# EAGLE design quadripod_v2 (EAGLE 9.3.0)
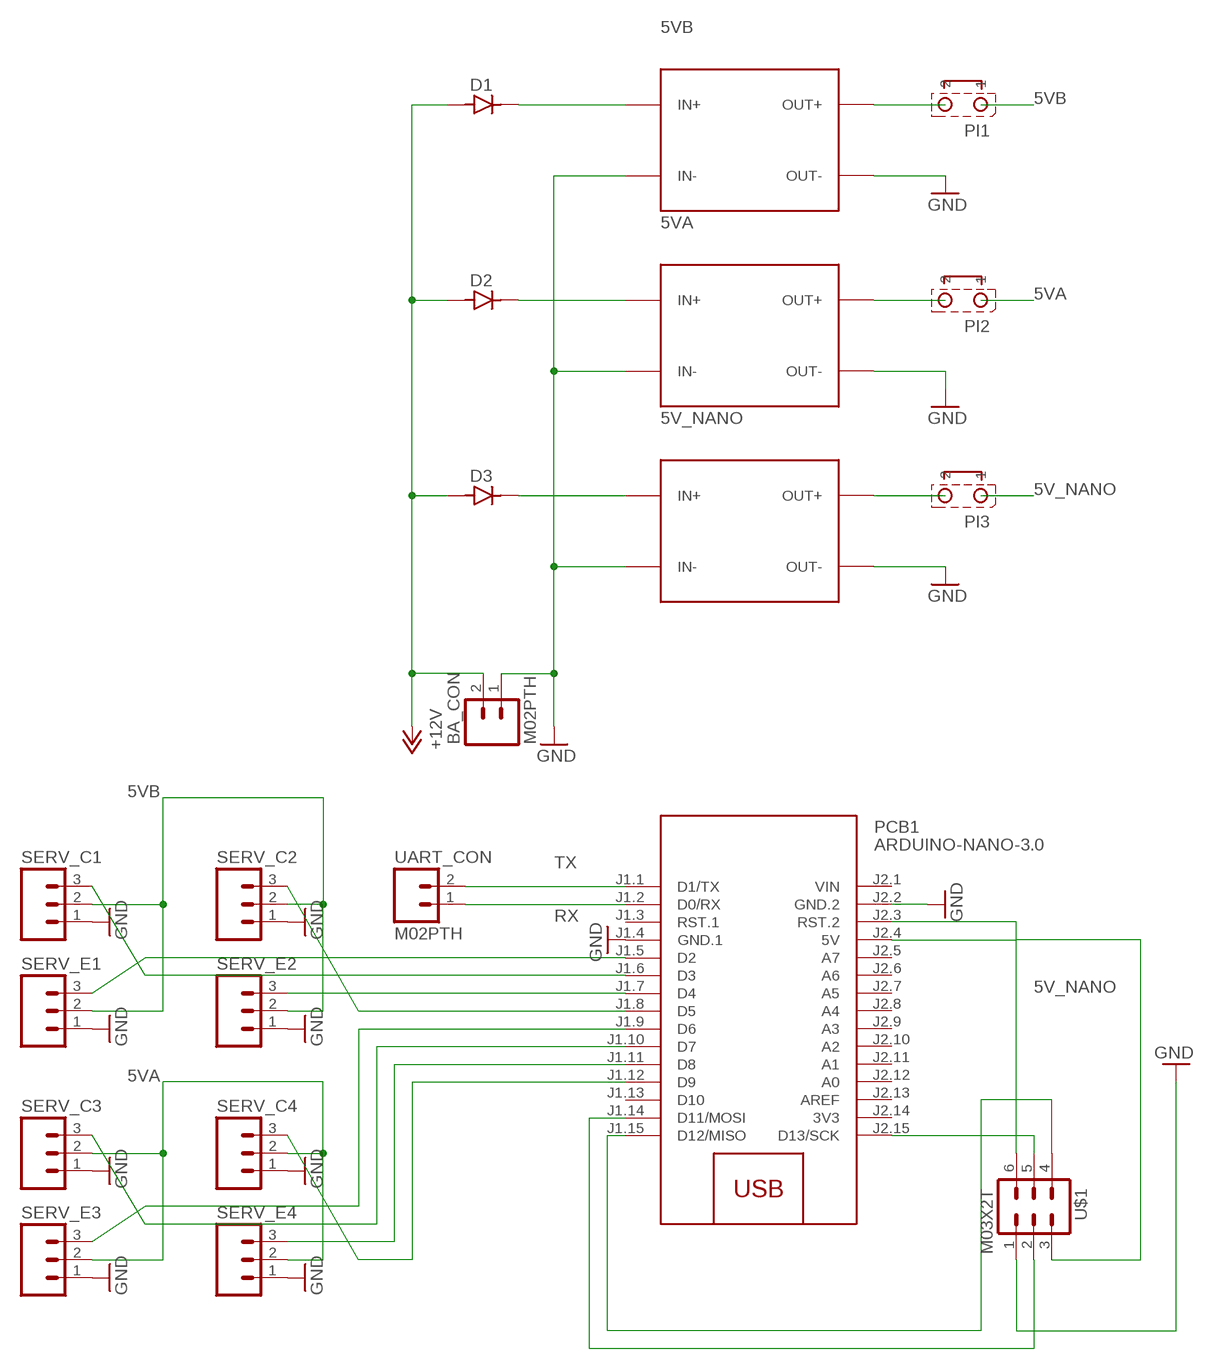
[diagram p0: schematic, sheet 1]

## Parts
5V_NANO  DC-DC-STEP-DOWN-LM2596  [DC-DC-STEP-DOWN-LM2596]
5VA  DC-DC-STEP-DOWN-LM2596  [DC-DC-STEP-DOWN-LM2596]
5VB  DC-DC-STEP-DOWN-LM2596  [DC-DC-STEP-DOWN-LM2596]
BA_CON  M02PTH  [1X02]
D1  DIODES_DIODE/DO41  [DIODES_DO41]
D2  DIODES_DIODE/DO41  [DIODES_DO41]
D3  DIODES_DIODE/DO41  [DIODES_DO41]
PCB1  ARDUINO-NANO-3.0  [ARDUINO-NANO-3.0]
PI1  STCMS_2  [STCMS_2]
PI2  STCMS_2  [STCMS_2]
PI3  STCMS_2  [STCMS_2]
SERV_C1  M03LONGPADS  [1X03_LONGPADS]
SERV_C2  M03LONGPADS  [1X03_LONGPADS]
SERV_C3  M03LONGPADS  [1X03_LONGPADS]
SERV_C4  M03LONGPADS  [1X03_LONGPADS]
SERV_E1  M03LONGPADS  [1X03_LONGPADS]
SERV_E2  M03LONGPADS  [1X03_LONGPADS]
SERV_E3  M03LONGPADS  [1X03_LONGPADS]
SERV_E4  M03LONGPADS  [1X03_LONGPADS]
U$1  M03X2T  [2X03]
UART_CON  M02PTH  [1X02]

## Nets
5V_NANO [power]: PCB1.J2.4(5V) PI3.1 U$1.3
5VA [power]: PI2.1 SERV_C3.2 SERV_C4.2 SERV_E3.2 SERV_E4.2
5VB: PI1.1 SERV_C1.2 SERV_C2.2 SERV_E1.2 SERV_E2.2
+12V [power]: BA_CON.2 D1.A D2.A D3.A
GND [power]: 5V_NANO.IN- 5V_NANO.OUT- 5VA.IN- 5VA.OUT- 5VB.IN- 5VB.OUT- BA_CON.1 PCB1.J1.4(GND.1) PCB1.J2.2(GND.2) SERV_C1.1 SERV_C2.1 SERV_C3.1 SERV_C4.1 SERV_E1.1 SERV_E2.1 SERV_E3.1 SERV_E4.1 U$1.1
N$1: 5VB.IN+ D1.K
N$2: PCB1.J1.5(D2) SERV_E1.3
N$3: 5VA.IN+ D2.K
N$4: 5V_NANO.IN+ D3.K
N$5: PCB1.J1.6(D3) SERV_C1.3
N$6: PCB1.J1.7(D4) SERV_E2.3
N$7: PCB1.J1.8(D5) SERV_C2.3
N$8: PCB1.J1.9(D6) SERV_E3.3
N$9: PCB1.J1.10(D7) SERV_C3.3
N$10: PCB1.J1.11(D8) SERV_E4.3
N$11: PCB1.J1.12(D9) SERV_C4.3
N$14: 5VB.OUT+ PI1.2
N$15: 5VA.OUT+ PI2.2
N$16: 5V_NANO.OUT+ PI3.2
N$17: PCB1.J1.14(D11/MOSI) U$1.2
N$18: PCB1.J2.3(RST.2) U$1.6
N$19: PCB1.J2.15(D13/SCK) U$1.5
N$20: PCB1.J1.15(D12/MISO) U$1.4
RX: PCB1.J1.2(D0/RX) UART_CON.1
TX: PCB1.J1.1(D1/TX) UART_CON.2
Unconnected: PCB1.J1.3(RST.1) PCB1.J1.13(D10) PCB1.J2.5(A7) PCB1.J2.6(A6) PCB1.J2.7(A5) PCB1.J2.8(A4) PCB1.J2.9(A3) PCB1.J2.10(A2) PCB1.J2.11(A1) PCB1.J2.12(A0) PCB1.J2.13(AREF)

## Power pins joined to a net without a drawn wire
3V3: PCB1.J2.14(3V3)
VIN: PCB1.J2.1(VIN)

## Library data of the parts
5V_NANO 5VA 5VB = diy-modules:DC-DC-STEP-DOWN-LM2596: DC/DC Step-Down Regulator based on LM2596-ADJ chip LM2596 datasheet available here: http://www.ti.com/lit/ds/symlink/lm2596.pdf Click here to find device on ebay.com <http://www.ebay.com/sch/lm2596+power+regulator>
BA_CON UART_CON = 7robot:M02: Standard 2-pin 2.54 header. Use with - straight break away headers ( PRT-00116) - right angle break away headers (PRT-00553) - swiss pins (PRT-00743) - machine pins (PRT-00117) - female headers (PRT-00115) Molex polarized connector foot print use with: PRT-08233 with associated crimp pins and housings. 2.54_SCREWTERM for use with PRT-10571. 3.5mm Screw Terminal footprints for PRT-08084 5mm Screw Terminal footprints for use with PRT-08433
D1-D3 = 7robot:DIODES_DIODE: BAS32L => SOD80
PCB1 = diy-modules:ARDUINO-NANO-3.0: Arduino Nano 3.0 and compatible devices More details available here: https://www.arduino.cc/en/Main/ArduinoBoardNano Click here to find device on ebay.com <http://www.ebay.com/sch/arduino+nano>
PI1-PI3 = 7robot:STCMS_2
SERV_C1-SERV_C4 SERV_E1-SERV_E4 = 7robot:M03: Header 3 Standard 3-pin 0.1" header. Use with straight break away headers (SKU : PRT-00116), right angle break away headers (PRT-00553), swiss pins (PRT-00743), machine pins (PRT-00117), and female headers (PRT-00115). Molex polarized connector foot print use with SKU : PRT-08232 with associated crimp pins and housings.
U$1 = 7robot:M03X2

## Net classes
0 default: width 0.5 mm, drill 0.2 mm, clearance 0.25 mm
1 power: width 1 mm, drill 0.5 mm, clearance 0.5 mm

## Board
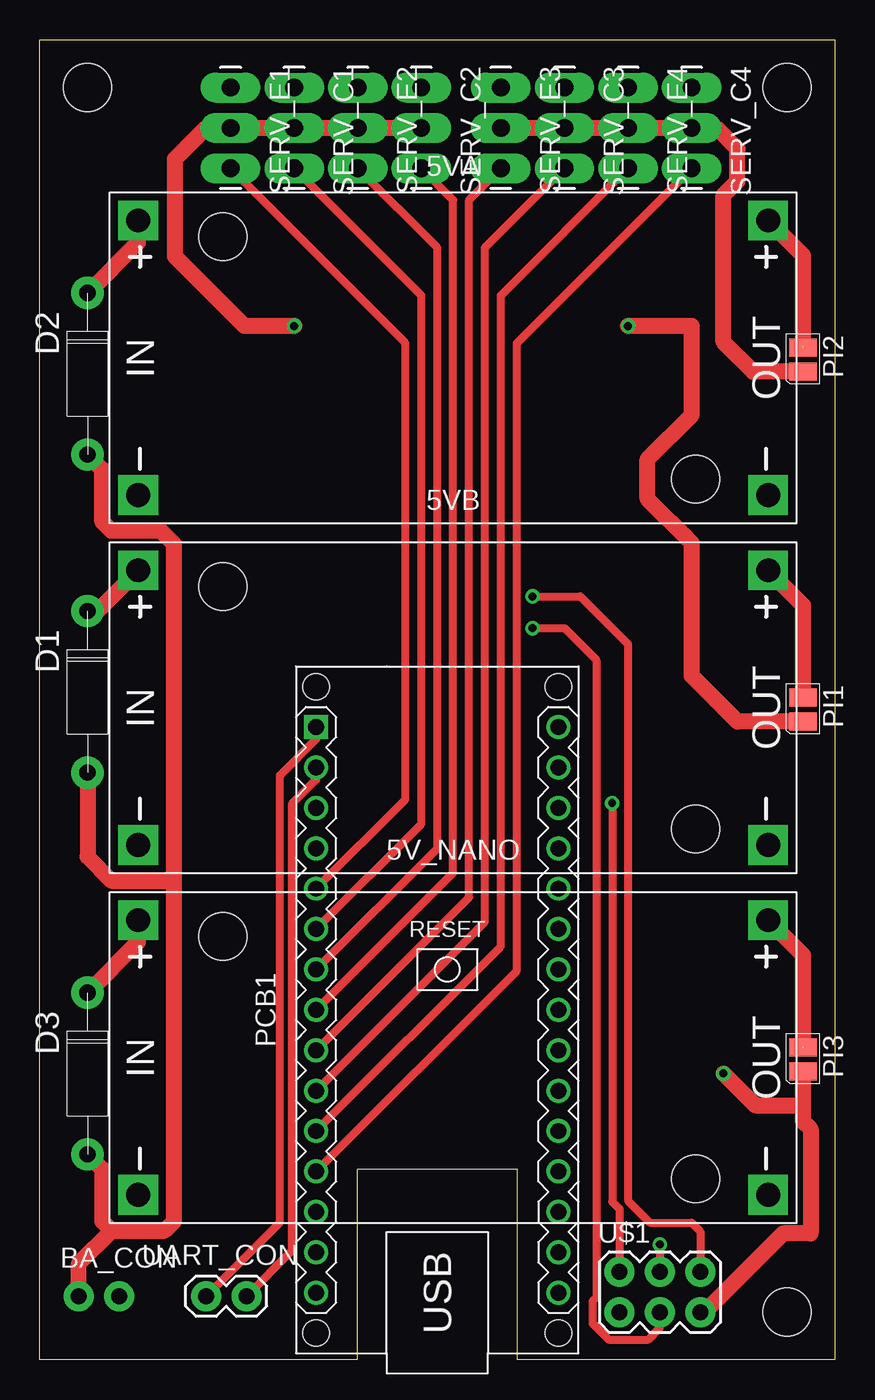
[diagram p1: board, top side]
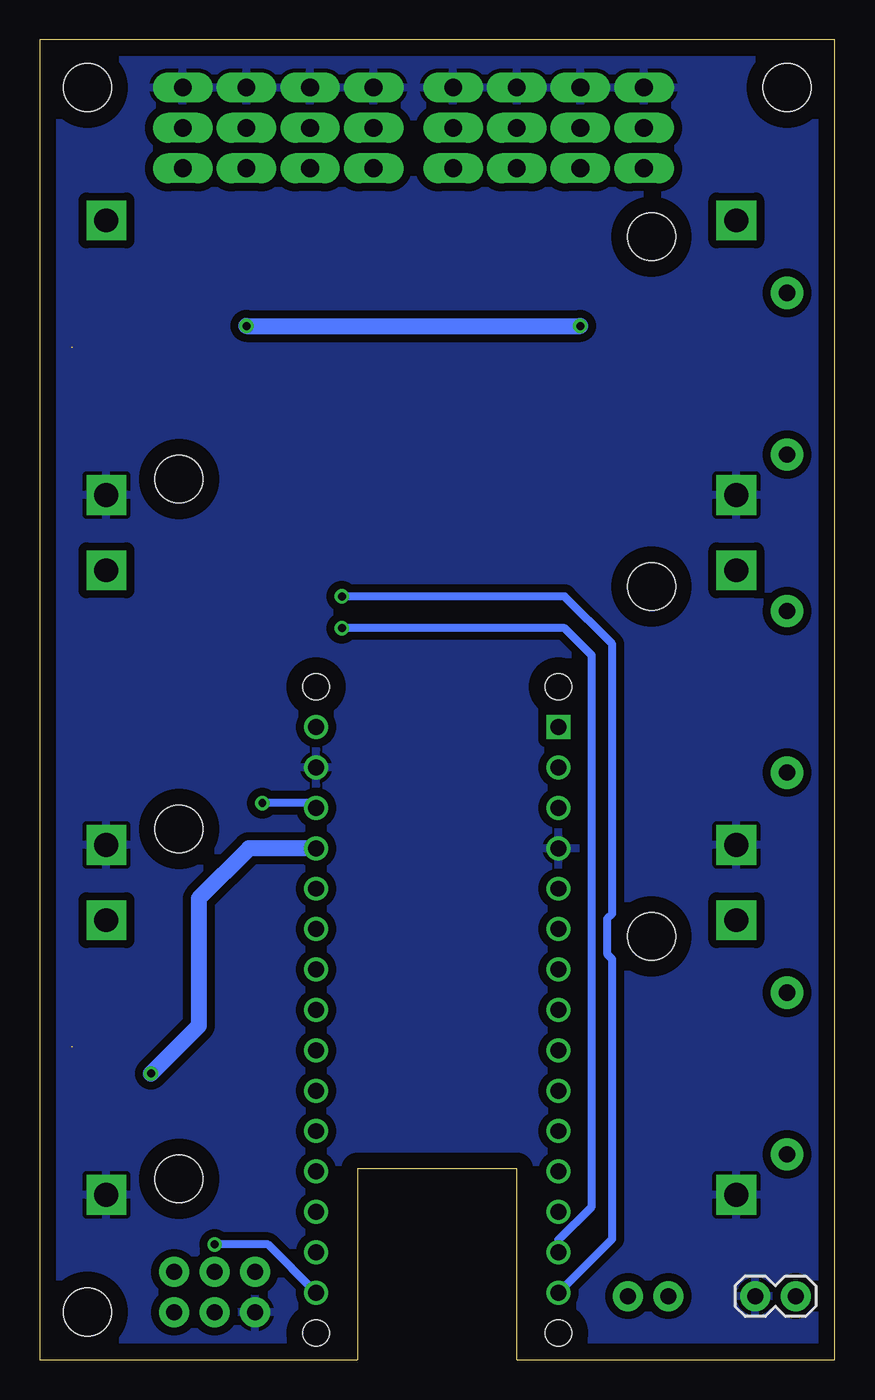
[diagram p2: board, bottom side, seen from below]

Size 50 x 83 mm. Coordinates in mm from the lower left corner, seen from the top.
Outline: 0,0 0,83 50,83 50,0 30,0 30,12 20,12 20,0 0,0
Copper layers (1*16): Top 0.035mm / dielectric 1.5mm / Bottom 0.035mm
Design rules "default": minimum track width 6mil, minimum drill 0.35mm, track to track 6mil, track to pad 6mil, pad to pad 6mil, via to via 6mil, smd to smd 6mil, copper to edge 40mil, drill to drill 6mil, minimum pad ring 10mil, minimum via ring 8mil, stop-mask expansion 4mil, vias tented up to drill 0mil, thermal gap 10mil
Holes 3 mm at 47,80 3,80 47,3

### Footprints (pad centres in the part's own frame; a part is rotated, then mirrored left to right if it is on the bottom)
DC-DC-STEP-DOWN-LM2596 = drill 1.5 pad 2.5 square: IN+ -19.812,8.636; IN- -19.812,-8.636; OUT+ 19.812,8.636; OUT- 19.812,-8.636 | hole 3: -14.478,7.62; 15.24,-7.62
1X02 = drill 1.016 pad 1.88: 1 0,0; 2 2.54,0
DIODES_DO41 = drill 1.016 pad 2.032: A 5.08,0; K -5.08,0
ARDUINO-NANO-3.0 = drill 1 square: J1.1 17.78,7.62 | drill 1: J1.2 15.24,7.62; J1.3 12.7,7.62; J1.4 10.16,7.62; J1.5 7.62,7.62; J1.6 5.08,7.62; J1.7 2.54,7.62; J1.8 0,7.62; J1.9 -2.54,7.62; J1.10 -5.08,7.62; J1.11 -7.62,7.62; J1.12 -10.16,7.62; J1.13 -12.7,7.62; J1.14 -15.24,7.62; J1.15 -17.78,7.62; J2.1 17.78,-7.62; J2.2 15.24,-7.62; J2.3 12.7,-7.62; J2.4 10.16,-7.62; J2.5 7.62,-7.62; J2.6 5.08,-7.62; J2.7 2.54,-7.62; J2.8 0,-7.62; J2.9 -2.54,-7.62; J2.10 -5.08,-7.62; J2.11 -7.62,-7.62; J2.12 -10.16,-7.62; J2.13 -12.7,-7.62; J2.14 -15.24,-7.62; J2.15 -17.78,-7.62 | hole 1.651: -20.32,7.62; -20.32,-7.62; 20.32,-7.62; 20.32,7.62
STCMS_2 = smd 1.727 x 1.143: 1 0,-0.873; 2 0,0.635
1X03_LONGPADS = drill 1.118 pad 1.88 long: 1 0,0; 2 2.54,0; 3 5.08,0
2X03 = drill 1.016 pad 1.88: 1 -2.54,-1.27; 2 0,-1.27; 3 2.54,-1.27; 4 2.54,1.27; 5 0,1.27; 6 -2.54,1.27

### Placement (x,y rotation side)
5V_NANO  26,19 0 top
5VA  26,63 0 top
5VB  26,41 0 top
BA_CON  5,4 0 bottom
D1  3,42 270 top
D2  3,62 270 top
D3  3,18 270 top
PCB1  25,22 90 top
PI1  48,41 0 top
PI2  48,63 0 top
PI3  48,19 0 top
SERV_C1  16,80 270 top
SERV_C2  24,80 270 top
SERV_C3  33,80 270 top
SERV_C4  41,80 270 top
SERV_E1  12,80 270 top
SERV_E2  20,80 270 top
SERV_E3  29,80 270 top
SERV_E4  37,80 270 top
U$1  39,4.25 0 top
UART_CON  13,4 180 top

### Tracks (layer width: path | path; a pad name or v marks a point on that pad's centre or on a via)
5V_NANO  (via drill 0.5)
  Top 1: PI3.1 48,16 | 48,16 48,15 48.48,14.52 48.48,7.94 46.75,7.94 41.79,2.98 U$1.3 | v43,18 45,16 48,16
  Bottom 1: PCB1.J2.4 36.84,32.16 40,29 40,21 v43,18
5VA
  Top 1: SERV_E3.2 SERV_C3.2 SERV_E4.2 SERV_C4.2 42.54,77.46 43.88,76.12 43.88,74.12 43,73.24 43,64 44.87,62.13 PI2.1
5VB  (via drill 0.5)
  Top 1: SERV_C2.2 SERV_E2.2 SERV_C1.2 SERV_E1.2 10.46,77.46 8.51,75.51 8.51,69.37 12.88,65 v16,65 | PI1.1 43.87,40.13 43,41 | 43,41 | 43,41 | 43,41 41,43 41,51.35 38.22,54.13 38.22,56.63 41,59.41 41,65 v37,65
  Bottom 1: v37,65 v16,65
+12V
  Top 1: D2.A 3.94,55.98 3.94,52.7 4.52,52.11 7.62,52.11 8.44,51.3 8.44,30 | 8.44,30 8.44,8.7 7.85,8.11 4.52,8.11 | 8.44,30 8.32,30.11 4.52,30.11 3,31.64 D1.A | D3.A 3.94,11.98 3.94,8.7 4.52,8.11 | BA_CON.2 2.46,6.05 4.52,8.11
GND
  pour Bottom: -2,-2 -2,85 52,85 52,-2
N$1
  Top 1: D1.K 3.63,47.08 5VB.IN+
N$2
  Top 0.508: PCB1.J1.5 23,35.24 23,63.92 SERV_E1.3
N$3
  Top 1: D2.K 6.19,70.27 5VA.IN+
N$4
  Top 1: D3.K 6.19,26.27 5V_NANO.IN+
N$5
  Top 0.508: PCB1.J1.6 24,33.7 24,66.92 SERV_C1.3
N$6
  Top 0.508: PCB1.J1.7 25,32.16 25,69.92 SERV_E2.3
N$7
  Top 0.508: PCB1.J1.8 26,30.62 26,72.92 SERV_C2.3
N$8
  Top 0.508: PCB1.J1.9 27,29.08 27,72.92 SERV_E3.3
N$9
  Top 0.508: PCB1.J1.10 28,27.54 28,69.92 SERV_C3.3
N$10
  Top 0.508: PCB1.J1.11 29,26 29,66.92 SERV_E4.3
N$11
  Top 0.508: PCB1.J1.12 30,24.46 30,63.92 SERV_C4.3
N$14
  Top 1: 5VB.OUT+ 48,47.45 PI1.2
N$15  (1 unrouted)
  Top 1: 5VA.OUT+ 48,69.45 48,63.7
N$16  (1 unrouted)
  Top 1: 5V_NANO.OUT+ 48,25.45 48,19.7
N$17  (via drill 0.5)
  Top 0.5: v31,46 33,46 35,44 35,3.91 34.77,3.68 34.77,2.28 35.78,1.27 38.27,1.27 39,2 U$1.2
  Bottom 0.5: PCB1.J1.14 17.38,7.53 15.29,9.62 15.29,44.29 17,46 v31,46
N$18  (via drill 0.5)
  Top 0.5: U$1.6 36.46,9.48 36,9.94 v36,35
  Bottom 0.5: PCB1.J2.3 32.92,35 v36,35
N$19  (via drill 0.5)
  Top 0.5: v39,7.25 U$1.5
  Bottom 0.5: PCB1.J2.15 35.65,7.25 v39,7.25
N$20  (via drill 0.5)
  Top 0.5: U$1.4 41.54,8.07 41,8.61 38.39,8.61 37,10 37,45 34,48 v31,48
  Bottom 0.5: PCB1.J1.15 14,7.6 14,25.19 14.29,25.47 14.29,27.77 14,28.05 14,45 17,48 v31,48
RX
  Top 0.508: PCB1.J1.2 17.38,36.48 15.87,34.97 15.87,6.87 UART_CON.1
TX
  Top 0.508: UART_CON.2 15.11,8.65 15.11,36.75 17.38,39.02 PCB1.J1.1

### Text on the board
tDocu: gnd | 5v | vin | tx | rx
bDocu: Thib-s / v1.0 Rev c